# Altium project Bop_it_pico_Pinout.PrjPcb
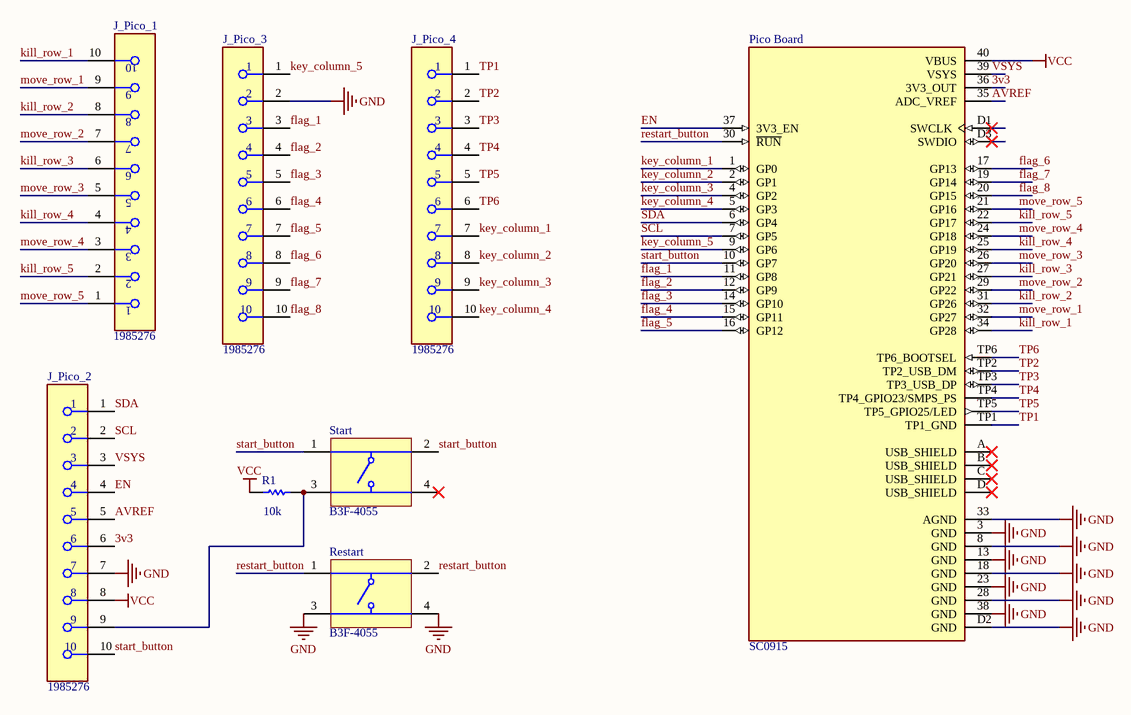
[diagram p0: Pico_pinout.SchDoc]
1 sheet, 8 parts. Net scope: global (net labels, ports and power ports of the same name join across sheets).
Board file: Pico_Main_Board.PcbDoc

## Sheet Pico_pinout.SchDoc
size D; SheetNumber: 1; SheetTotal: 1

### Parts
J_Pico_1  1985276  [FP-1985276-MFG]
J_Pico_2  1985276  [FP-1985276-MFG]
J_Pico_3  1985276  [FP-1985276-MFG]
J_Pico_4  1985276  [FP-1985276-MFG]
Pico_Board  SC0915  [MODULE_SC0915]
R1  10k  [RESC3116X65X40ML10T20]
Restart  B3F-4055  [OMRON-B3F-4055_V]
Start  B3F-4055  [OMRON-B3F-4055_V]

### Nets
GND: J_Pico_2.7 J_Pico_3.2 Pico_Board.3(GND) Pico_Board.8(GND) Pico_Board.13(GND) Pico_Board.18(GND) Pico_Board.23(GND) Pico_Board.28(GND) Pico_Board.33(AGND) Pico_Board.38(GND) Pico_Board.D2(GND) Restart.3 Restart.4
VCC: J_Pico_2.8 Pico_Board.40(VBUS) R1.1
3v3: J_Pico_2.6 Pico_Board.36(3V3_OUT)
AVREF: J_Pico_2.5 Pico_Board.35(ADC_VREF)
EN: J_Pico_2.4 Pico_Board.37(3V3_EN)
flag_1: J_Pico_3.3 Pico_Board.11(GP8)
flag_2: J_Pico_3.4 Pico_Board.12(GP9)
flag_3: J_Pico_3.5 Pico_Board.14(GP10)
flag_4: J_Pico_3.6 Pico_Board.15(GP11)
flag_5: J_Pico_3.7 Pico_Board.16(GP12)
flag_6: J_Pico_3.8 Pico_Board.17(GP13)
flag_7: J_Pico_3.9 Pico_Board.19(GP14)
flag_8: J_Pico_3.10 Pico_Board.20(GP15)
key_column_1: J_Pico_4.7 Pico_Board.1(GP0)
key_column_2: J_Pico_4.8 Pico_Board.2(GP1)
key_column_3: J_Pico_4.9 Pico_Board.4(GP2)
key_column_4: J_Pico_4.10 Pico_Board.5(GP3)
key_column_5: J_Pico_3.1 Pico_Board.9(GP6)
kill_row_1: J_Pico_1.10 Pico_Board.34(GP28)
kill_row_2: J_Pico_1.8 Pico_Board.31(GP26)
kill_row_3: J_Pico_1.6 Pico_Board.27(GP21)
kill_row_4: J_Pico_1.4 Pico_Board.25(GP19)
kill_row_5: J_Pico_1.2 Pico_Board.22(GP17)
move_row_1: J_Pico_1.9 Pico_Board.32(GP27)
move_row_2: J_Pico_1.7 Pico_Board.29(GP22)
move_row_3: J_Pico_1.5 Pico_Board.26(GP20)
move_row_4: J_Pico_1.3 Pico_Board.24(GP18)
move_row_5: J_Pico_1.1 Pico_Board.21(GP16)
restart_button: Pico_Board.30(~{RUN}) Restart.1 Restart.2
SCL: J_Pico_2.2 Pico_Board.7(GP5)
SDA: J_Pico_2.1 Pico_Board.6(GP4)
start_button: J_Pico_2.10 Pico_Board.10(GP7) Start.1 Start.2
TP1: J_Pico_4.1 Pico_Board.TP1(TP1_GND)
TP2: J_Pico_4.2 Pico_Board.TP2(TP2_USB_DM)
TP3: J_Pico_4.3 Pico_Board.TP3(TP3_USB_DP)
TP4: J_Pico_4.4 Pico_Board.TP4(TP4_GPIO23/SMPS_PS)
TP5: J_Pico_4.5 Pico_Board.TP5(TP5_GPIO25/LED)
TP6: J_Pico_4.6 Pico_Board.TP6(TP6_BOOTSEL)
VSYS: J_Pico_2.3 Pico_Board.39(VSYS)
NetJ_Pico_2_9: J_Pico_2.9 R1.2 Start.3

Not connected (* = marked no-connect by the designer): Pico_Board A(USB_SHIELD)* B(USB_SHIELD)* C(USB_SHIELD)* D(USB_SHIELD)* D1(SWCLK)* D3(SWDIO)*; Start 4*

### Library data of the parts
J_Pico_1-J_Pico_4 = CMP-00298-00128517-1: 1985276 Barrier Strip Terminal Block, 2A, 1.5mm2, 1 Row(s), 1 Deck(s); NexarPartId: 128517; Number of Contacts: 10; Wire Gauge (Min): 20AWG; Stripping Length: 8mm; Wire/Cable Gauge: 16AWG; Pitch: 3.5mm; Voltage: 300V; Approvals: UL, VDE; Max Supply Voltage: 250V; Number of Levels: 1; Housing Material: Polyamide; Max Current Rating: 2A; Packaging: Bulk; RoHS: Compliant; Termination: Solder; Number of Rows: 1; Material: Nylon; Current: 2A; Number of Positions: 10; Number of Positions Per Level: 10; Contact Material: Tin; Wire Gauge (Max): 20AWG; Number of Pins: 10; Insulation Material: Nylon; Housing Color: Green; Radiation Hardening: No; Flammability Rating: UL94 V-0; Current Rating: 2A; Length: 12mm; Height: 13.1mm; Max Operating Temperature: 100°C; Min Operating Temperature: -40°C; Mount: Through Hole; Lead Free: Lead Free; Contact Plating: Tin; Weight: 4.93001g; Number of Circuits: 10; Voltage Rating: 250V; Ambient Temperature Range High: 100°C; Depth: 12mm; Width: 36.5mm; Number of Poles: 10; Color: Green
Pico_Board = SC0915: RP2040 Raspberry Pi Pico series ARMÂ® CortexÂ®-M0+ MCU 32-Bit Embedded Evaluation Board; SnapEDA_Link: https://www.snapeda.com/parts/SC0915/Raspberry+Pi/view-part/?ref=snap; Availability: In Stock; Package: None; Price: None; MP: SC0915; Check_prices: https://www.snapeda.com/parts/SC0915/Raspberry+Pi/view-part/?ref=eda; MF: Raspberry Pi; Value: *; Purchase-URL: https://pricing.snapeda.com/search/part/SC0915/?ref=eda
R1 = CMP-1014-00623-2: Chip Resistor, 10 KOhm, +/- 1%, 0.25 W, -55 to 155 degC, 1206 (3216 Metric), RoHS, Tape and Reel; Manufacturer: Yageo; Voltage Rating: 200V; Resistance: 10KOhm; Temperature Coefficient: 100ppm/degreesC; Power Rating: 250mW; Packaging: TapeandReel; Termination: SMD/SMT; REACH SVHC: Unknown; Tolerance: 1%; Height: 0.55mm; Composition: ThickFilm; Max Operating Temperature: 155degC; Datasheet Version: Rev. 5, 10/2016; Lead Free: LeadFree; Case Code (Metric): 3216; Depth: 1.6mm; Package Quantity: 5000; RoHSCompliant: true; Military Standard: Not; Case/Package: 1206; Case Code (Imperial): 1206; Min Operating Temperature: -55degC; Datasheet URL: http://www.yageo.com/NewPortal/yageodocoutput?fileName=/pdf/R-Chip/PYu-RC_Group_51_RoHS_L_5.pdf; Length: 3.1mm; Manufacturer URL: http://www.yageo.com/; Package Reference: 1206.0; Width: 1.6mm; Package Description: 2-Pin Surface Mount Device, Body 3.1 x 1.6 mm
Restart Start = CMP-2000-05902-1: Tactile Switch, 1 to 50 mA, 100 mOhm Max, 5 to 24 VDC, -25 to 70 degC, 4-Pin THD, RoHS, Bulk; Manufacturer: OmronElectronics; Contact Rating @ Voltage: 0.05@24VDCA; Pole Throw Configuration: SPST; Dielectric Strength: 500VAC; Maximum DC Voltage Rating: 24V; Electrical Life: 1000000Cycles; Product Weight: 0.85g; Switch Configuration: N.O.; Actuator Style: ProjectedPlunger; Actuator Color: Orange; Actuator Length: 3mm; Illumination Type: N/R; Body Orientation: Straight; Operating Force: 2.55N; Ground Terminal: No; Datasheet URL: https://datasheet.ciiva.com/20148/78-0136-20148640.pdf; Seal Location: N/A; Mechanical Life: N/A; Operating Temperature: -25to70C; Maximum AC Voltage Rating: N/A; Dimension: 12x12x7.3mm; Minimum Insulation Resistance: 100MOhm; Mounting: ThroughHole,PCPins; Housing Material: N/A; Packaging: Bag; Part No: B3F-4055; Maximum Contact Resistance: 100mOhm; Base Material: N/A; Manufacturer URL: http://www.omron.com/; RoHS: Yes; Contact Material: N/A; Package Description: 4-Pin Through Hole Device, Body 12 x 12 mm; Family: B3F; Mounting Technology: ThroughHole; Package Reference: B3F-4055; Contact Plating: Gold; Seal Description: N/A; Type: Miniature; Datasheet Version: 06/2009